# EAGLE design receiver_shield (EAGLE 7.2.0)
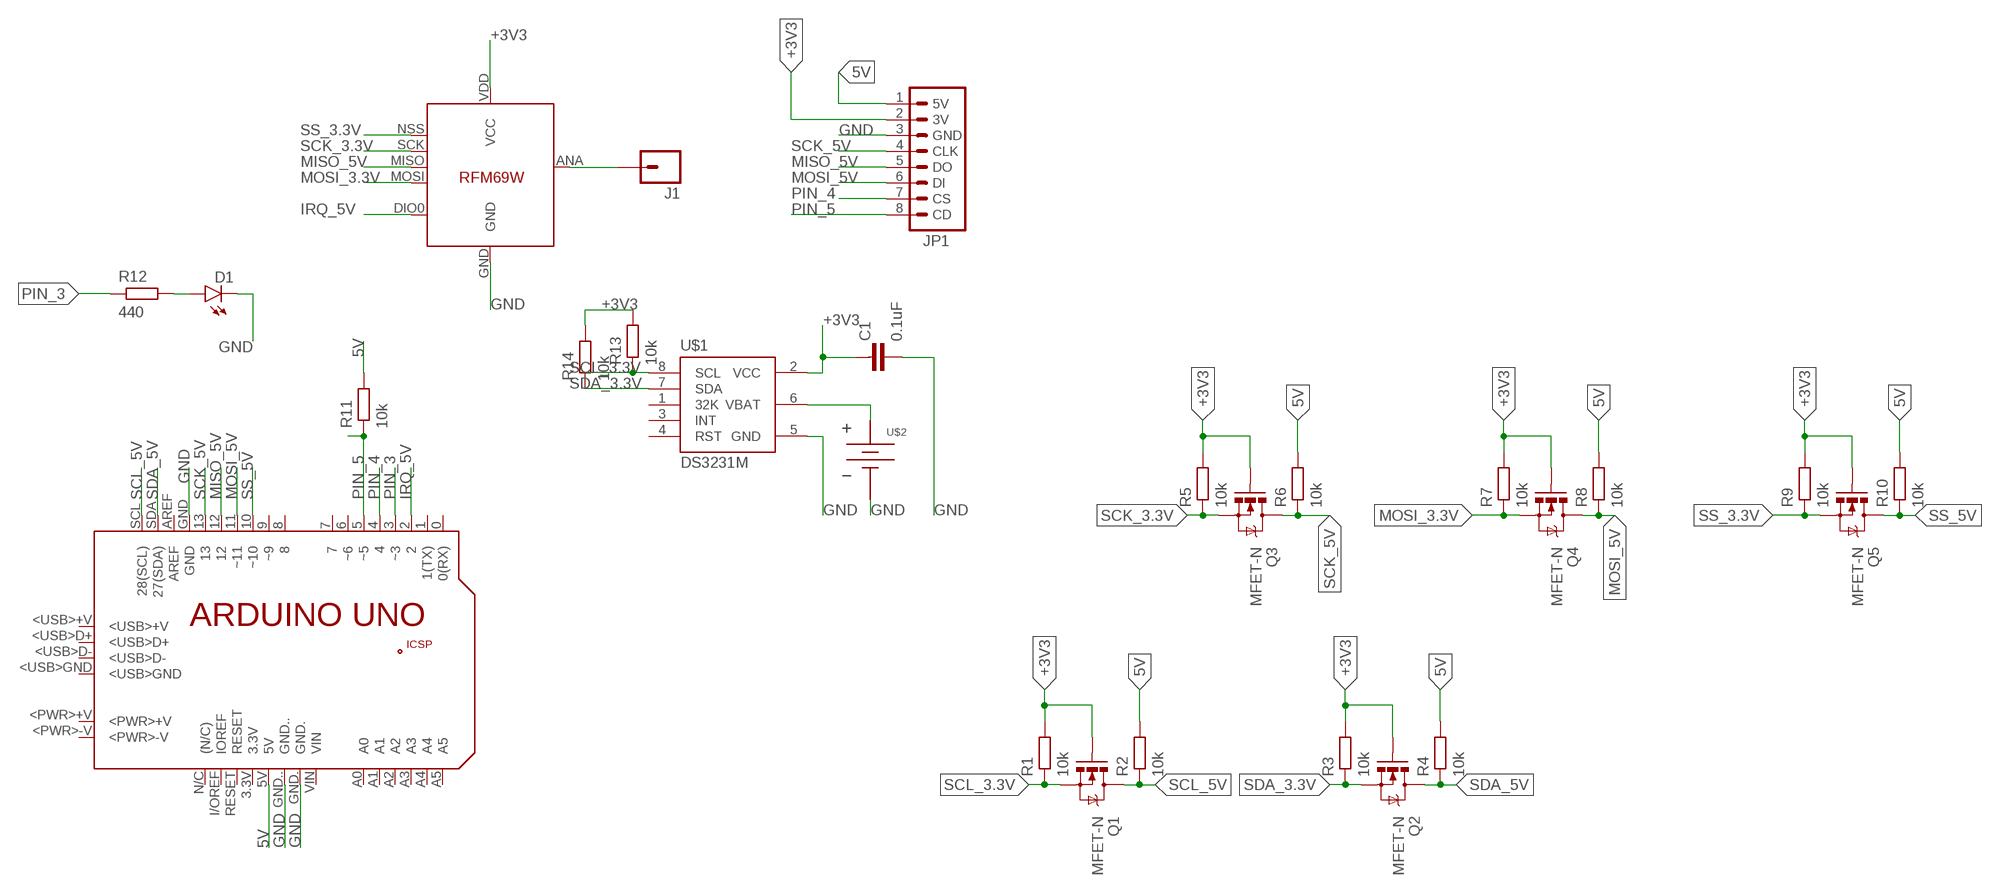
[diagram p0: schematic, sheet 1]

## Parts
C1  0.1uF  CAPACITOR0603-N  [C0603-N]
D1  LED0603  [LED-0603]
J1  M01NOSILK-KIT  [1X01NS-KIT]
JP1  SDCARD_BREAKOUT_HEADER1X08  [SD_HEADER]
PCB1  ARDUINO_UNO  [ARDUINO_UNO]
Q1  MFET-N  MOSFET-NCHANNELAO3404A  [SOT23-3]
Q2  MFET-N  MOSFET-NCHANNELAO3404A  [SOT23-3]
Q3  MFET-N  MOSFET-NCHANNELAO3404A  [SOT23-3]
Q4  MFET-N  MOSFET-NCHANNELAO3404A  [SOT23-3]
Q5  MFET-N  MOSFET-NCHANNELAO3404A  [SOT23-3]
R1  10k  RESISTOR0603-N  [R0603-N]
R2  10k  RESISTOR0603-N  [R0603-N]
R3  10k  RESISTOR0603-N  [R0603-N]
R4  10k  RESISTOR0603-N  [R0603-N]
R5  10k  RESISTOR0603-N  [R0603-N]
R6  10k  RESISTOR0603-N  [R0603-N]
R7  10k  RESISTOR0603-N  [R0603-N]
R8  10k  RESISTOR0603-N  [R0603-N]
R9  10k  RESISTOR0603-N  [R0603-N]
R10  10k  RESISTOR0603-N  [R0603-N]
R11  10k  RESISTOR0603-N  [R0603-N]
R12  440  RESISTOR0603-N  [R0603-N]
R13  10k  RESISTOR0603-N  [R0603-N]
R14  10k  RESISTOR0603-N  [R0603-N]
U$1  DS3231M  [SO08]
U$2  2032_BAT_HLDR  [2032_BAT_HLDR_MPD]
U$4  RFM69  [RFM69W-MINPADS]

## Nets
5V: JP1.1(5V) PCB1.5V R2.2 R4.2 R6.2 R8.2 R10.2 R11.2
+3V3: C1.1 JP1.2(3V) Q1.1(G) Q2.1(G) Q3.1(G) Q4.1(G) Q5.1(G) R1.2 R3.2 R5.2 R7.2 R9.2 R13.2 R14.2 U$1.2(VCC) U$4.VDD(VCC)
GND: C1.2 D1.C JP1.3(GND) PCB1.GND PCB1.GND. PCB1.GND.. U$1.5(GND) U$2.P$1(GND) U$4.GND
IRQ_5V: PCB1.2 U$4.DIO0
MISO_5V: JP1.5(DO) PCB1.12 U$4.MISO
MOSI_3.3V: Q4.2(S) R7.1 U$4.MOSI
MOSI_5V: JP1.6(DI) PCB1.11(~11) Q4.3(D) R8.1
N$1: D1.A R12.2
N$2: U$1.6(VBAT) U$2.P$2(VBAT)
N$3: J1.1 U$4.ANA(ANT)
PIN_3: PCB1.3(~3) R12.1
PIN_4: JP1.7(CS) PCB1.4
PIN_5: JP1.8(CD) PCB1.5(~5) R11.1
SCK_3.3V: Q3.2(S) R5.1 U$4.SCK
SCK_5V: JP1.4(CLK) PCB1.13 Q3.3(D) R6.1
SCL_3.3V: Q1.2(S) R1.1 R13.1 U$1.8(SCL)
SCL_5V: PCB1.SCL(28(SCL)) Q1.3(D) R2.1
SDA_3.3V: Q2.2(S) R3.1 R14.1 U$1.7(SDA)
SDA_5V: PCB1.SDA(27(SDA)) Q2.3(D) R4.1
SS_3.3V: Q5.2(S) R9.1 U$4.NSS(SEL)
SS_5V: PCB1.10(~10) Q5.3(D) R10.1
Unconnected: PCB1.0(0(RX)) PCB1.1(1(TX)) PCB1.3.3V PCB1.6(~6) PCB1.7 PCB1.8 PCB1.9(~9) PCB1.+5V PCB1.<PWR>+V PCB1.<PWR>-V PCB1.<USB>+V PCB1.<USB>D+ PCB1.<USB>D- PCB1.<USB>GND PCB1.A0 PCB1.A1 PCB1.A2 PCB1.A3 PCB1.A4 PCB1.A5 PCB1.AREF PCB1.GND_ PCB1.I/OREF(IOREF) PCB1.MISO PCB1.MOSI PCB1.N/C((N/C)) PCB1.RESET PCB1.RESET. PCB1.SCK PCB1.VIN U$1.1(32K) U$1.3(INT) U$1.4(RST)

## Library data of the parts
C1 = passives-7351:CAPACITOR
D1 = SparkFun-LED:LED: LEDs Standard schematic elements and footprints for 5mm, 3mm, 1206, and 0603 sized LEDs. 5mm - Spark Fun Electronics SKU : COM-00529 (and others)
J1 = SparkFun-Connectors:M01: Header 1 Standard 1-pin 0.1" header. Use with straight break away headers (SKU : PRT-00116), right angle break away headers (PRT-00553), swiss pins (PRT-00743), machine pins (PRT-00117), and female headers (PRT-00115). SMTSO-256-ET is a "flush mount" nut for a 4-40 screw. The older package used to be too tight, and did not allow it to sit properly thru the drill hit. The latest (0.165DIA) fits nice and snug.
JP1 = _my-parts:SDCARD_BREAKOUT_HEADER: Header 8 Standard 8-pin 0.1" header. Use with straight break away headers (SKU : PRT-00116), right angle break away headers (PRT-00553), swiss pins (PRT-00743), machine pins (PRT-00117), and female headers (PRT-00115).
PCB1 = Arduino_revB:ARDUINO_UNO: Device for representing an Arduino Uno board with a footprint in an EAGLE design. Created by Dave Young for Element14. More EAGLE documentation at: http://www.element14.com/community/community/knode/cadsoft_eagle
Q1-Q5 = SparkFun-DiscreteSemi:MOSFET-NCHANNEL: Common NMOSFET Parts MFG P/N Store ID Prod ID FDD8780 TRANS-09984 SI7820DN TRANS-11055 FDS6630A IC-08089 2N7002PW TRANS-11151 FQP30N06L COM-10213 TRANS-10060 BSS123LT1G TRANS-08345 BSS138 TRANS-00830 BS170 2N7000; PROD_ID: TRAN-12988
R1-R14 = passives-7351:RESISTOR
U$1 = _my-parts:DS3231M: The DS3231M is a low-cost, extremely accurate, I2C realtime clock (RTC). Datasheet <https://datasheets.maximintegrated.com/en/ds/DS3231M.pdf>
U$2 = _my-parts:2032_BAT_HLDR
U$4 = LowPowerLab:RFM69

## Board
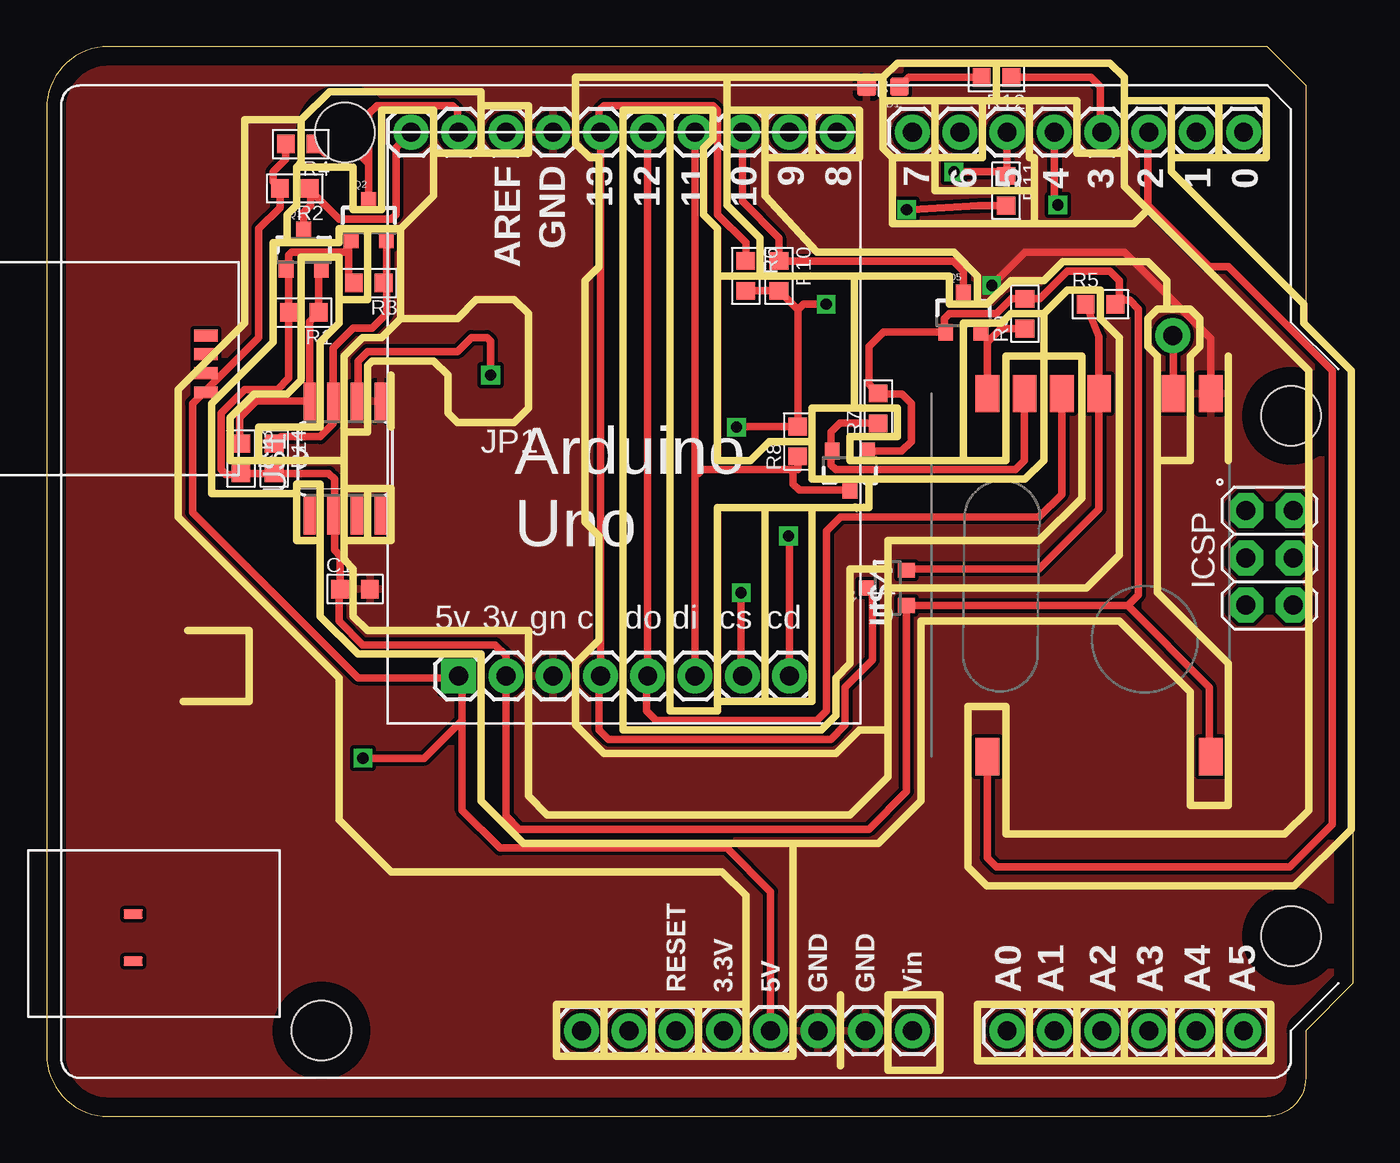
[diagram p1: board, top side]
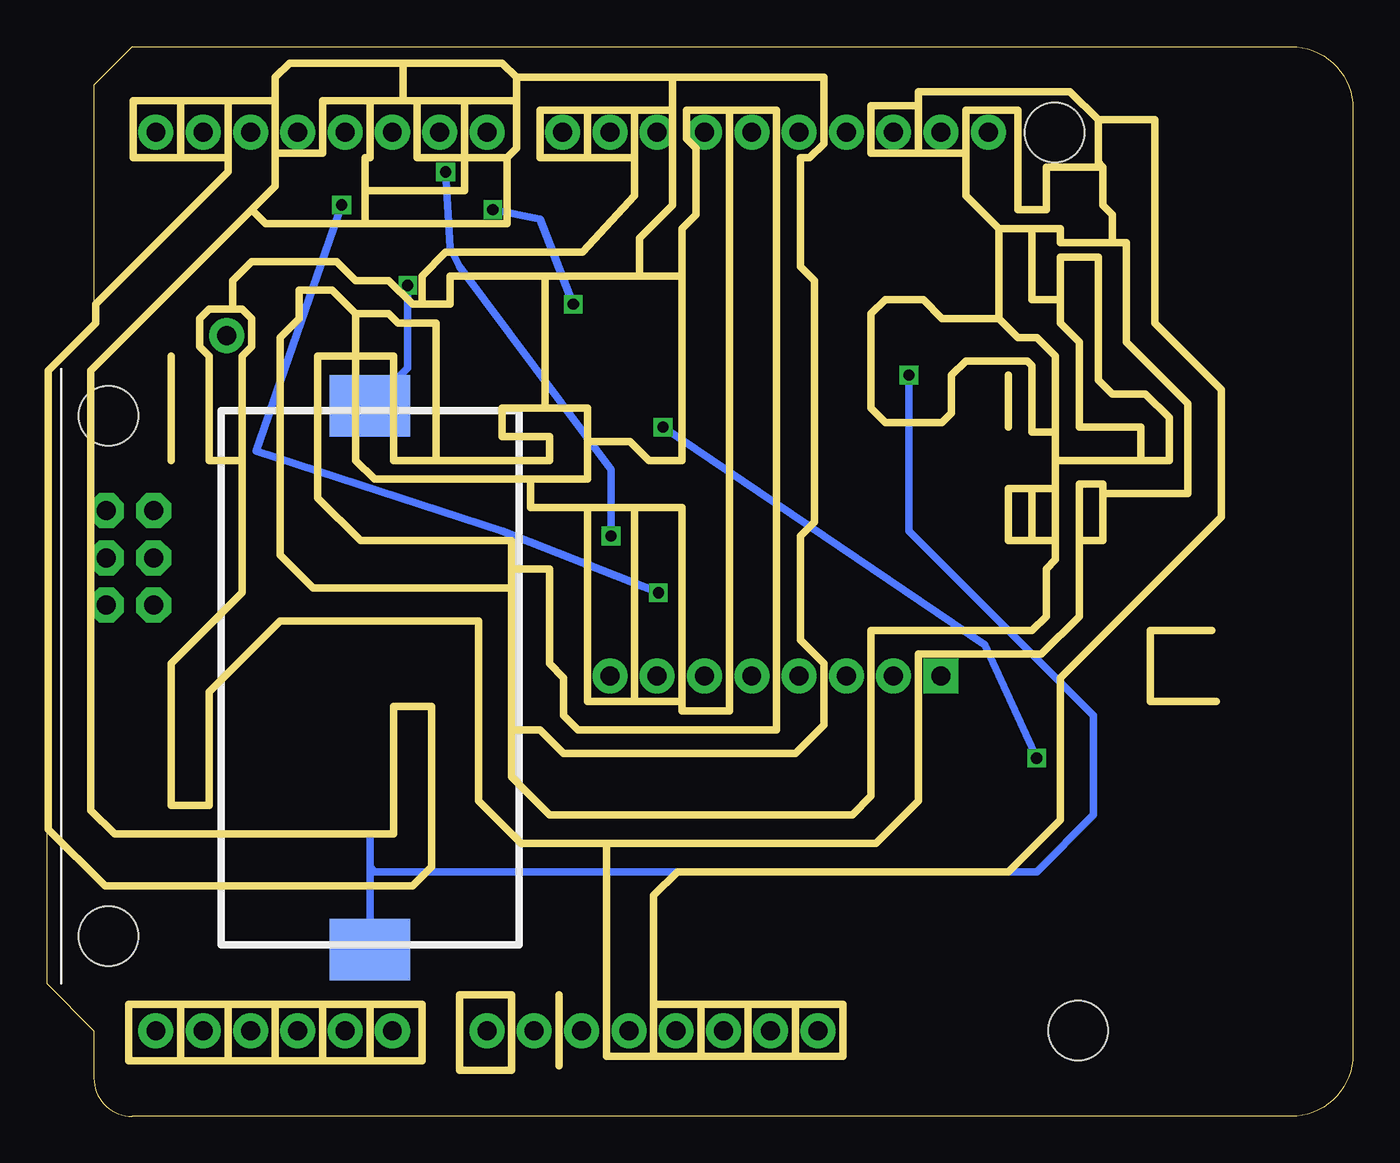
[diagram p2: board, bottom side, seen from below]

Size 70.17 x 57.47 mm. Coordinates in mm from the lower left corner, seen from the top.
Outline: 3.33,0 65.56,0 arc90 67.63,2.06 67.63,4.6 70.17,7.14 70.17,40.16 67.63,42.7 67.63,55.4 65.56,57.47 3.33,57.47 arc90 0,54.13 0,3.33 arc90 3.33,0
Copper layers (1*16): Top 0.035mm / dielectric 1.5mm / Bottom 0.035mm
Design rules "default": minimum track width 10mil, minimum drill 24mil, track to track 8mil, track to pad 8mil, pad to pad 8mil, via to via 8mil, smd to smd 8mil, copper to edge 40mil, drill to drill 8mil, minimum pad ring 10mil, minimum via ring 8mil, stop-mask expansion 4mil, vias tented up to drill 0mil, thermal gap 10mil
Milling: 336 lines

### Footprints (pad centres in the part's own frame; a part is rotated, then mirrored left to right if it is on the bottom)
C0603-N = smd 0.95 x 1: 1 -0.8,0; 2 0.8,0
LED-0603 = smd 1 x 1: A 0,-0.877; C 0,0.877
1X01NS-KIT = drill 1.016 pad 1.88: 1 0,0
SD_HEADER = drill 1.016 pad 1.88 square: 1 3.81,2.54 | drill 1.016 pad 1.88: 2 6.35,2.54; 3 8.89,2.54; 4 11.43,2.54; 5 13.97,2.54; 6 16.51,2.54; 7 19.05,2.54; 8 21.59,2.54
ARDUINO_UNO = drill 1.016 pad 1.88: 0 63.5,50.8; 1 60.96,50.8; 2 58.42,50.8; 3 55.88,50.8; 3.3V 35.56,2.54; 4 53.34,50.8; 5 50.8,50.8; 5V 38.1,2.54; 6 48.26,50.8; 7 45.72,50.8; 8 41.656,50.8; 9 39.116,50.8; 10 36.576,50.8; 11 34.036,50.8; 12 31.496,50.8; 13 28.956,50.8; A0 50.8,2.54; A1 53.34,2.54; A2 55.88,2.54; A3 58.42,2.54; A4 60.96,2.54; A5 63.5,2.54; AREF 23.876,50.8; GND 26.416,50.8; GND. 43.18,2.54; GND.. 40.64,2.54; I/OREF 30.48,2.54; N/C 27.94,2.54; RESET 33.02,2.54; SCL 18.796,50.8; SDA 21.336,50.8; VIN 45.72,2.54 | drill 1.016 pad 1.88 octagon: +5V 66.167,30.48; GND_ 66.167,25.4; MISO 63.627,30.48; MOSI 66.167,27.94; RESET. 63.627,25.4; SCK 63.627,27.94 | smd 1.016 x 0.508: <PWR>+V 3.861,8.814; <PWR>-V 3.861,6.274 | smd 1.27 x 0.635: <USB>+V 7.772,39.878; <USB>D+ 7.772,38.887; <USB>D- 7.772,37.871; <USB>GND 7.772,36.83 | hole 3.2: 66.04,7.62; 66.04,35.56; 15.24,50.8; 13.97,2.54
SOT23-3 = smd 0.8 x 0.9: 1 -0.95,-1; 2 0.95,-1; 3 0,1.1
R0603-N = smd 0.95 x 1: 1 -0.8,0; 2 0.8,0
SO08 = smd 0.66 x 2.032: 1 -1.905,-3.073; 2 -0.635,-3.073; 3 0.635,-3.073; 4 1.905,-3.073; 5 1.905,3.073; 6 0.635,3.073; 7 -0.635,3.073; 8 -1.905,3.073
2032_BAT_HLDR_MPD = smd 3.302 x 4.318: P$1 -14.605,0; P$2 14.605,0
RFM69W-MINPADS = smd 2 x 1.27: ANA 8,-5; DIO0 -11.5,5; GND 8,-7; MISO 8,1; MOSI 8,3; NSS 8,5; SCK 8,-1; VDD -11.5,-7

### Placement (x,y rotation side)
C1  16.57,28.32 0 top
D1  44.93,55.31 90 top
J1  60.48,41.94 0 top
JP1  18.32,21.11 0 top
PCB1  0.79,2.06 0 top
Q1  13.81,46.51 0 top
Q2  17.3,48.1 0 top
Q3  45.18,28.38 90 top
Q4  43.15,34.73 180 top
Q5  49.24,43.12 0 top
R1  13.81,43.18 180 top
R2  13.34,49.85 180 top
R3  17.3,44.77 180 top
R4  13.65,52.23 180 top
R5  56.61,43.62 0 top
R6  37.56,45.15 270 top
R7  44.67,38.04 90 top
R8  40.35,36.26 90 top
R9  52.55,43.12 90 top
R10  39.34,45.15 270 top
R11  51.53,49.72 270 top
R12  51.02,55.82 180 top
R13  10.45,35.34 270 top
R14  12.22,35.34 270 top
U$1  16.03,35.34 0 top
U$2  52.8,23.56 270 bottom
U$4  55.53,30.83 90 top

### Tracks (layer width: path | path; a pad name or v marks a point on that pad's centre or on a via)
5V  (via drill 0.6)
  Top 0.406: R4.2 12.85,51.43 12.16,50.74 12.16,50.22 R2.2 12.54,48.83 11.4,47.69 11.4,41.85 7.84,38.29 7.84,32.45 16.73,23.56 22.03,23.56 JP1.1 22.32,23.46 22.32,21.27 22.19,21.15 | 40.35,43.33 R8.2 37.09,37.06 v37.05,37.02 | 40.35,43.33 R10.2 R6.2 | v16.99,19.24 20.29,19.24 22.19,21.15 | PCB1.5V 38.89,12.07 36.54,14.41 24.35,14.41 22.32,16.45 22.32,21.02 22.19,21.15 | R11.2 50.04,48.92 46.45,48.7 v46.2,48.7 | v41.88,43.62 40.65,43.62 40.35,43.33
  Bottom 0.406: v37.05,37.02 19.78,25.34 v16.99,19.24 | v46.2,48.7 43.66,48.2 v41.88,43.62
+3V3
  Top 0.406: 13.01,45.36 R1.2 13.01,39.65 12.41,39.05 10.64,39.05 9.37,37.78 9.37,34.73 9.62,34.48 10.39,34.48 R13.2 R14.2 15.15,34.54 15.46,34.23 15.46,32.33 U$1.2 15.46,32.2 15.46,30.42 15.77,30.11 C1.1 15.72,28.26 15.72,26.61 16.99,25.34 24.1,25.34 24.67,24.76 JP1.2 24.67,16.13 25.37,15.43 44.16,15.43 46.2,17.46 46.2,27.42 Q3.1 58.07,27.43 | 13.01,45.36 Q1.1 | 13.01,45.36 13.01,46.25 13.18,46.42 16.22,46.42 | 16.22,46.42 16.22,46.97 Q2.1 | 16.22,46.42 16.22,45.05 R3.2 | 57.63,43.84 R5.2 | Q4.1 45.93,35.73 46.45,36.26 46.45,38.29 45.94,38.8 44.71,38.8 R7.2 44.16,39.34 44.16,41.34 44.94,42.12 Q5.1 48.23,42.18 48.23,42.86 48.48,43.12 51.02,43.12 51.82,43.92 R9.2 53.35,43.92 54.83,45.4 57.12,45.4 57.63,44.89 57.63,43.84 | 58.07,27.43 62.45,23.05 62.45,19.41 U$4.VDD | 57.63,43.84 58.17,43.84 58.64,43.37 58.64,28.01 58.07,27.43
GND  (via drill 0.6)
  Top 0.406: U$4.GND 62.53,41.77 57.88,46.42 52.55,46.42 v50.77,44.64
  Bottom 0.406: v50.77,44.64 50.77,40.2 U$2.P$1
  pour Top: -0.79,-0.57 73.63,-0.57 73.63,62.42 -0.79,62.42
IRQ_5V
  Top 0.406: U$4.DIO0 50.53,13.89 51.02,13.4 66.77,13.4 69.06,15.68 69.06,40.07 63.47,45.66 62.45,45.66 59.15,48.96 59.15,52.8 PCB1.2
MISO_5V
  Top 0.406: PCB1.12 JP1.5 32.23,23.59 32.23,21.78 32.73,21.27 41.37,21.27 41.88,21.78 41.88,31.43 42.64,32.19 53.31,32.19 54.53,33.42 U$4.MISO
MOSI_3.3V
  Top 0.406: U$4.MOSI 52.53,35.23 52.04,34.73 42.39,34.73 42.13,34.99 42.13,35.67 Q4.2 42.13,35.8 42.13,36.77 42.6,37.24 R7.1
MOSI_5V
  Top 0.406: PCB1.11 34.83,34.73 | 34.83,34.73 JP1.6 | 34.83,34.73 35.02,34.54 35.21,34.73 40.1,34.73 | 40.1,34.73 40.35,34.73 R8.1 | Q4.3 40.44,33.63 40.1,33.97 40.1,34.73
N$1
  Top 0.406: R12.2 46.31,55.82 D1.A
N$2  (via drill 0.6)
  Top 0.406: U$1.6 16.73,38.47 16.73,40.58 17.24,41.08 22.07,41.08 22.83,41.85 23.65,41.85 23.84,41.66 v23.84,39.81
  Bottom 0.406: U$2.P$2 52.8,13.4 | 52.8,13.4 52.8,14.92 | v23.84,39.81 23.84,31.43 13.94,21.53 13.94,16.19 16.99,13.14 52.55,13.14 52.8,13.4
N$3
  Top 0.406: U$4.ANA 60.53,41.89 J1.1
PIN_3
  Top 0.406: R12.1 56.1,55.82 56.61,55.31 56.61,52.93 PCB1.3
PIN_4  (via drill 0.6)
  Top 0.406: PCB1.4 54.13,49.15 v54.32,48.96 | v37.31,28.13 37.31,23.72 JP1.7
  Bottom 0.406: v54.32,48.96 58.9,35.75 45.69,31.43 v37.31,28.13
PIN_5  (via drill 0.6)
  Top 0.406: PCB1.5 51.59,50.58 R11.1 51.31,50.74 v48.74,50.74 | JP1.8 39.91,31.12 v39.85,31.18
  Bottom 0.406: v39.85,31.18 39.85,34.73 47.97,45.66 48.48,46.67 v48.74,50.74
SCK_3.3V
  Top 0.406: R5.1 56.53,41.89 U$4.SCK 56.53,32.62 53.31,29.4 46.25,29.4 Q3.2
SCK_5V
  Top 0.406: Q3.3 44.35,28.12 44.35,24.5 42.89,23.05 42.89,21.02 42.13,20.26 30.19,20.26 29.69,20.76 29.69,23.59 JP1.4 PCB1.13 29.69,52.93 29.69,54.04 29.94,54.29 35.78,54.29 36.04,54.04 36.04,48.45 37.56,46.93 R6.1
SCL_3.3V
  Top 0.406: R13.1 10.38,36.2 10.38,37.53 11.27,38.41 U$1.8 14.13,42.7 R1.1 14.61,45.36 Q1.2
SCL_5V
  Top 0.406: Q1.3 13.81,48.58 14.19,48.96 14.19,49.79 R2.1 14.14,49.78 15.72,48.2 18.51,48.2 18.76,48.45 18.76,52.04 PCB1.SCL
SDA_3.3V
  Top 0.406: R14.1 12.6,36.51 14.7,36.51 15.4,37.21 U$1.7 15.4,41.28 16.48,42.35 17.49,42.35 18.26,43.12 18.26,44.61 R3.1 18.25,44.92 Q2.2
SDA_5V
  Top 0.406: Q2.3 17.3,51.18 | 17.3,51.18 16.73,51.75 14.93,51.75 R4.1 | 17.3,51.18 17.3,53.85 17.75,54.29 21.81,54.29 22.07,54.04 22.07,52.93 PCB1.SDA
SS_3.3V
  Top 0.406: U$4.NSS 50.53,41.59 | 50.53,41.59 50.53,41.78 Q5.2 | R9.1 51.25,42.32 50.53,41.59
SS_5V
  Top 0.406: PCB1.10 37.37,49.15 39.34,47.18 R10.1 48.7,45.95 49.24,45.4 Q5.3